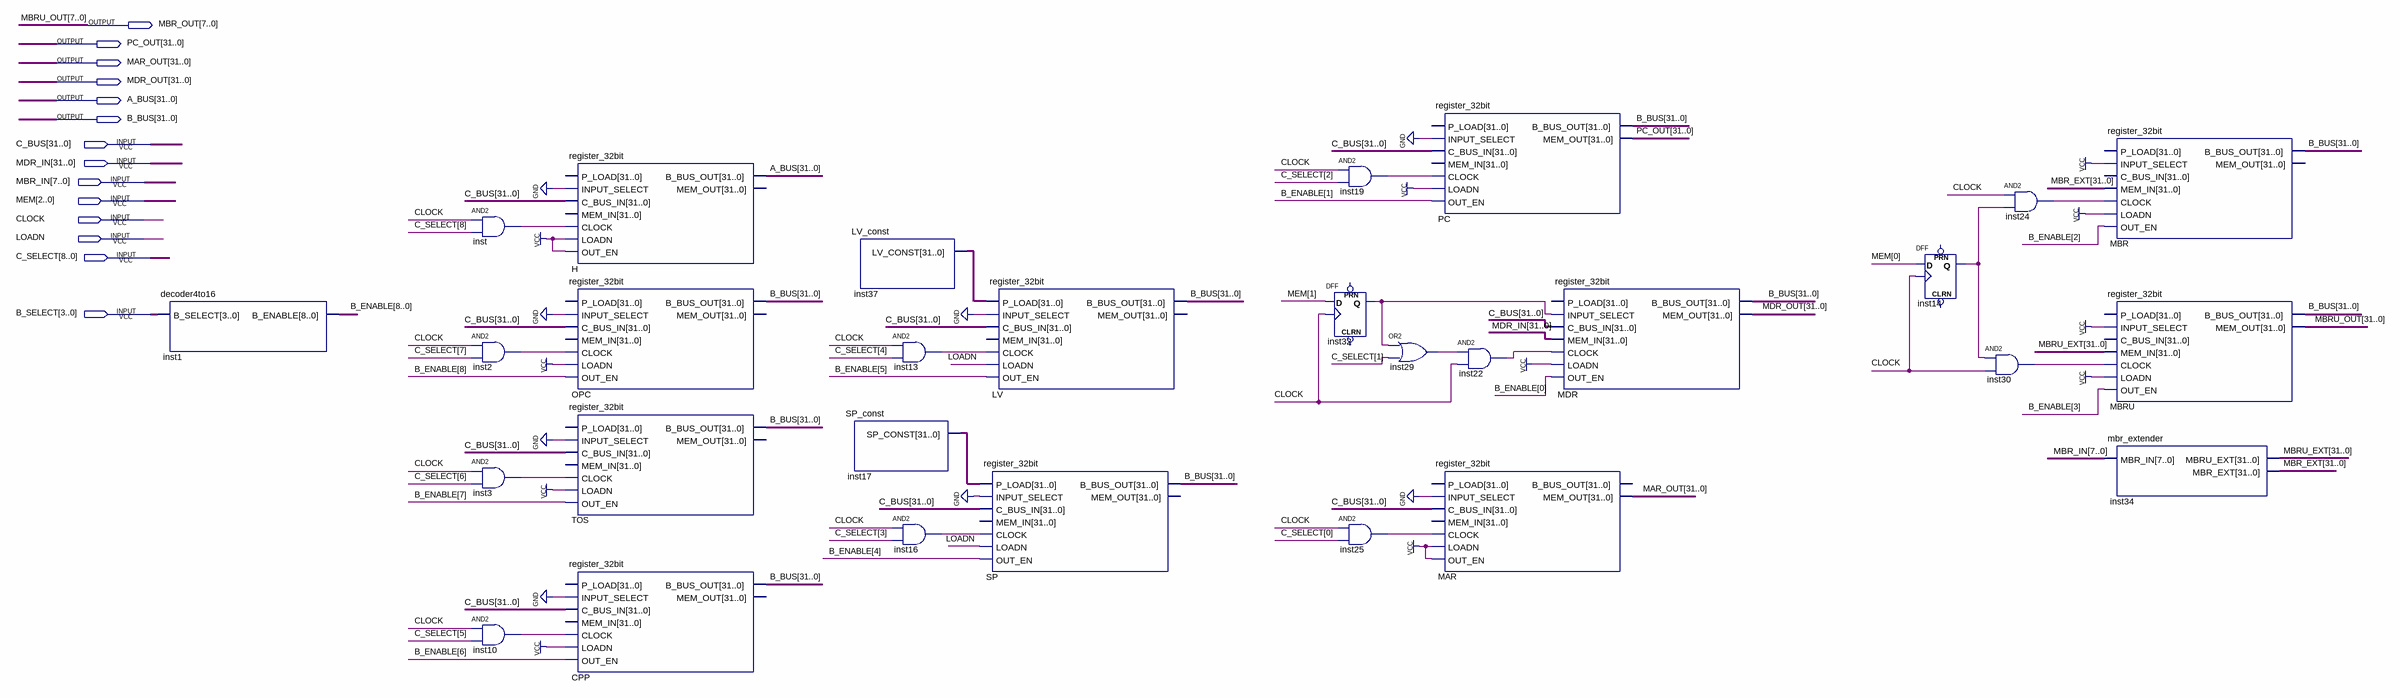
[diagram p0: schematic sheet]
// Quartus schematic REGISTER_BANK.bdf as structural Verilog: 29 symbols, 14 pins
module REGISTER_BANK (
  input  [31:0] C_BUS,
  input  [31:0] MDR_IN,
  input  [7:0] MBR_IN,
  input  [2:0] MEM,
  input  CLOCK,
  input  LOADN,
  input  [8:0] C_SELECT,
  input  [3:0] B_SELECT,
  output [7:0] MBR_OUT,
  output [31:0] PC_OUT,
  output [31:0] MAR_OUT,
  output [31:0] MDR_OUT,
  output [31:0] A_BUS,
  output [31:0] B_BUS
);

  wire inst2_out, inst3_out, inst10_out, inst13_out, inst14_q, inst16_out, inst19_out, inst22_out,
       inst24_out, inst25_out, inst29_out, inst30_out, inst32_q, inst_out;
  wire [8:0] B_ENABLE;
  wire [31:0] inst17_sp_const, inst37_lv_const, MBR_EXT, MBRU_EXT;
  wire [31:8] MBRU_OUT;

  decoder4to16 inst1 (.B_SELECT(B_SELECT), .B_ENABLE(B_ENABLE));
  and inst (inst_out, CLOCK, C_SELECT[8]);
  and inst2 (inst2_out, CLOCK, C_SELECT[7]);
  and inst3 (inst3_out, CLOCK, C_SELECT[6]);
  and inst10 (inst10_out, CLOCK, C_SELECT[5]);
  register_32bit H (
    .INPUT_SELECT(1'b0), .C_BUS_IN(C_BUS), .CLOCK(inst_out), .LOADN(1'b1), .OUT_EN(1'b1), .B_BUS_OUT(A_BUS));  // open: P_LOAD, MEM_IN, MEM_OUT
  register_32bit OPC (
    .INPUT_SELECT(1'b0), .C_BUS_IN(C_BUS), .CLOCK(inst2_out), .LOADN(1'b1), .OUT_EN(B_ENABLE[8]),
    .B_BUS_OUT(B_BUS));  // open: P_LOAD, MEM_IN, MEM_OUT
  register_32bit TOS (
    .INPUT_SELECT(1'b0), .C_BUS_IN(C_BUS), .CLOCK(inst3_out), .LOADN(1'b1), .OUT_EN(B_ENABLE[7]),
    .B_BUS_OUT(B_BUS));  // open: P_LOAD, MEM_IN, MEM_OUT
  register_32bit CPP (
    .INPUT_SELECT(1'b0), .C_BUS_IN(C_BUS), .CLOCK(inst10_out), .LOADN(1'b1), .OUT_EN(B_ENABLE[6]),
    .B_BUS_OUT(B_BUS));  // open: P_LOAD, MEM_IN, MEM_OUT
  LV_const inst37 (.LV_CONST(inst37_lv_const));
  SP_const inst17 (.SP_CONST(inst17_sp_const));
  and inst13 (inst13_out, CLOCK, C_SELECT[4]);
  and inst16 (inst16_out, CLOCK, C_SELECT[3]);
  register_32bit LV (
    .P_LOAD(inst37_lv_const), .INPUT_SELECT(1'b0), .C_BUS_IN(C_BUS), .CLOCK(inst13_out), .LOADN(LOADN),
    .OUT_EN(B_ENABLE[5]), .B_BUS_OUT(B_BUS));  // open: MEM_IN, MEM_OUT
  register_32bit SP (
    .P_LOAD(inst17_sp_const), .INPUT_SELECT(1'b0), .C_BUS_IN(C_BUS), .CLOCK(inst16_out), .LOADN(LOADN),
    .OUT_EN(B_ENABLE[4]), .B_BUS_OUT(B_BUS));  // open: MEM_IN, MEM_OUT
  DFF inst32 (.CLK(CLOCK), .D(MEM[1]), .Q(inst32_q));  // open: CLRN, PRN
  and inst19 (inst19_out, CLOCK, C_SELECT[2]);
  and inst25 (inst25_out, CLOCK, C_SELECT[0]);
  or inst29 (inst29_out, inst32_q, C_SELECT[1]);
  register_32bit PC (
    .INPUT_SELECT(1'b0), .C_BUS_IN(C_BUS), .CLOCK(inst19_out), .LOADN(1'b1), .OUT_EN(B_ENABLE[1]),
    .B_BUS_OUT(B_BUS), .MEM_OUT(PC_OUT));  // open: P_LOAD, MEM_IN
  and inst22 (inst22_out, inst29_out, CLOCK);
  register_32bit MAR (
    .INPUT_SELECT(1'b0), .C_BUS_IN(C_BUS), .CLOCK(inst25_out), .LOADN(1'b1), .OUT_EN(1'b1), .MEM_OUT(MAR_OUT));  // open: P_LOAD, MEM_IN, B_BUS_OUT
  register_32bit MDR (
    .INPUT_SELECT(inst32_q), .C_BUS_IN(C_BUS), .MEM_IN(MDR_IN), .CLOCK(inst22_out), .LOADN(1'b1),
    .OUT_EN(B_ENABLE[0]), .B_BUS_OUT(B_BUS), .MEM_OUT(MDR_OUT));  // open: P_LOAD
  DFF inst14 (.CLK(CLOCK), .D(MEM[0]), .Q(inst14_q));  // open: CLRN, PRN
  and inst24 (inst24_out, CLOCK, inst14_q);
  and inst30 (inst30_out, inst14_q, CLOCK);
  register_32bit MBR (
    .INPUT_SELECT(1'b1), .MEM_IN(MBR_EXT), .CLOCK(inst24_out), .LOADN(1'b1), .OUT_EN(B_ENABLE[2]),
    .B_BUS_OUT(B_BUS));  // open: P_LOAD, C_BUS_IN, MEM_OUT
  register_32bit MBRU (
    .INPUT_SELECT(1'b1), .MEM_IN(MBRU_EXT), .CLOCK(inst30_out), .LOADN(1'b1), .OUT_EN(B_ENABLE[3]),
    .B_BUS_OUT(B_BUS), .MEM_OUT({MBRU_OUT, MBR_OUT}));  // open: P_LOAD, C_BUS_IN
  mbr_extender inst34 (.MBR_IN(MBR_IN), .MBRU_EXT(MBRU_EXT), .MBR_EXT(MBR_EXT));

  // Other names for the same wires on the sheet: MBRU_OUT[7:0] = MBR_OUT
endmodule
